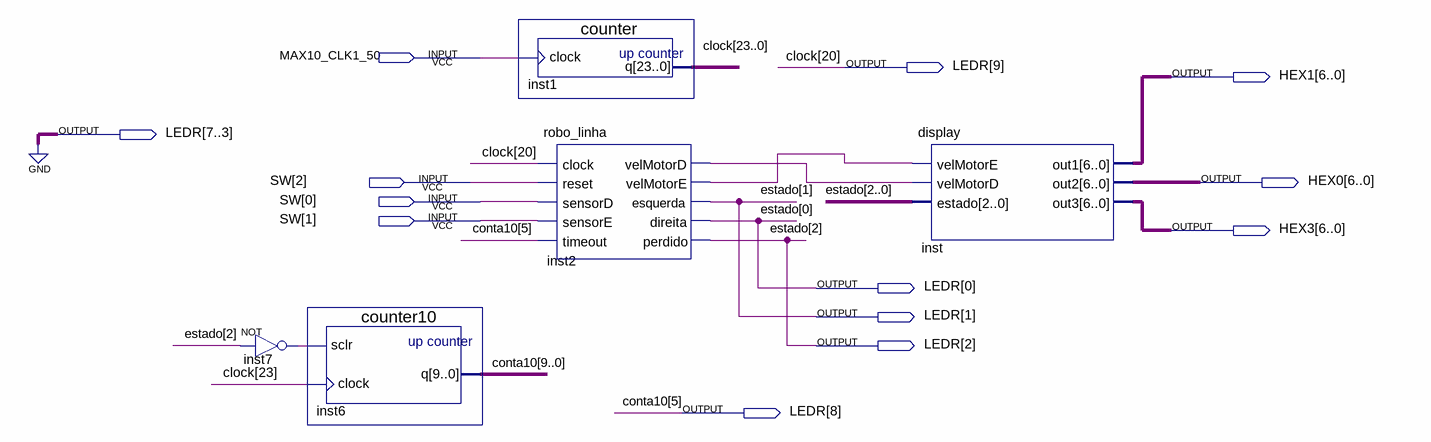
[diagram p0: schematic sheet]
// Quartus schematic Block1.bdf as structural Verilog: 5 symbols, 13 pins
module Block1 (
  input  MAX10_CLK1_50,
  input  [2:0] SW,
  output [9:0] LEDR,
  output [6:0] HEX1,
  output [6:0] HEX0,
  output [6:0] HEX3
);

  wire inst2_velmotord, inst2_velmotore, inst7_out;
  wire [9:0] conta10;
  wire [23:0] clock;

  not inst7 (inst7_out, LEDR[2]);
  counter10 inst6 (.sclr(inst7_out), .clock(clock[23]), .q({conta10[9:6], LEDR[8], conta10[4:0]}));
  counter inst1 (.clock(MAX10_CLK1_50), .q({clock[23:21], LEDR[9], clock[19:0]}));
  robo_linha inst2 (
    .clock(LEDR[9]), .reset(SW[2]), .sensorD(SW[0]), .sensorE(SW[1]), .timeout(LEDR[8]),
    .velMotorD(inst2_velmotord), .velMotorE(inst2_velmotore), .esquerda(LEDR[1]), .direita(LEDR[0]),
    .perdido(LEDR[2]));
  display inst (
    .velMotorE(inst2_velmotore), .velMotorD(inst2_velmotord), .estado(LEDR[2:0]), .out1(HEX1), .out2(HEX0),
    .out3(HEX3));

  assign LEDR[7:3] = {5{1'b0}};

  // Other names for the same wires on the sheet: clock[20] = LEDR[9]; conta10[5] = LEDR[8]; estado[2:0] = LEDR[2:0]
endmodule
